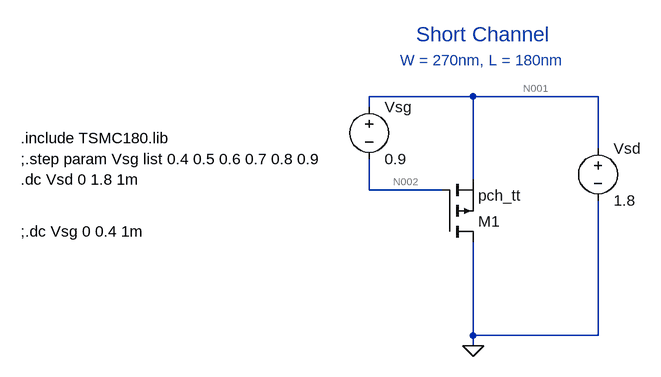
[diagram p0: schematic Q4_pmos_sc.asc]
Q4_pmos_sc.asc, the LTspice schematic file:
Version 4
SHEET 1 880 680
WIRE 240 32 80 32
WIRE 432 32 240 32
WIRE 80 48 80 32
WIRE 432 112 432 32
WIRE 240 160 240 32
WIRE 80 176 80 128
WIRE 192 176 80 176
WIRE 240 400 240 256
WIRE 432 400 432 192
WIRE 432 400 240 400
WIRE 240 416 240 400
FLAG 240 416 0
SYMBOL voltage 432 96 R0
WINDOW 123 0 0 Left 0
WINDOW 39 0 0 Left 0
SYMATTR InstName Vsd
SYMATTR Value 1.8
SYMBOL pmos 192 256 M180
SYMATTR InstName M1
SYMATTR Value pch_tt
SYMATTR Value2 L = 180n W = 270n
SYMBOL voltage 80 32 R0
WINDOW 123 0 0 Left 0
WINDOW 39 0 0 Left 0
SYMATTR InstName Vsg
SYMATTR Value 0.9
TEXT -456 96 Left 2 !.include TSMC180.lib
TEXT -456 128 Left 2 !;.step param Vsg list 0.4 0.5 0.6 0.7 0.8 0.9
TEXT -456 160 Left 2 !.dc Vsd 0 1.8 1m
TEXT -456 240 Left 2 !;.dc Vsg 0 0.4 1m
TEXT 152 -64 Left 3 ;Short Channel
TEXT 128 -24 Left 2 ;W = 270nm, L = 180nm

The netlist it stands for:
* Q4_pmos_sc.asc
Vsd N001 0 1.8
M1 0 N002 N001 N001 pch_tt L = 180n W = 270n
Vsg N001 N002 0.9
.model NMOS NMOS
.model PMOS PMOS
.lib standard.mos
.include TSMC180.lib
;.step param Vsg list 0.4 0.5 0.6 0.7 0.8 0.9
.dc Vsd 0 1.8 1m
;.dc Vsg 0 0.4 1m
* Short Channel
* W = 270nm, L = 180nm
.backanno
.end

* Results of the author's LTspice run, read from the files saved beside the schematic
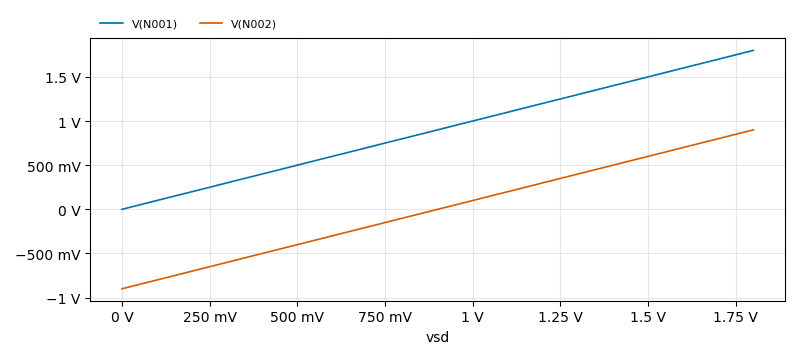
[diagram p1: DC transfer characteristic of Q4_pmos_sc.asc, plotted from the saved traces]
* DC transfer characteristic, 1 run:
*   V(N001): 0 V at vsd=0 V, 1.8 V at vsd=1.8 V, min 0 V, max 1.8 V
*   V(N002): -900 mV at vsd=0 V, 900 mV at vsd=1.8 V, min -900 mV, max 900 mV